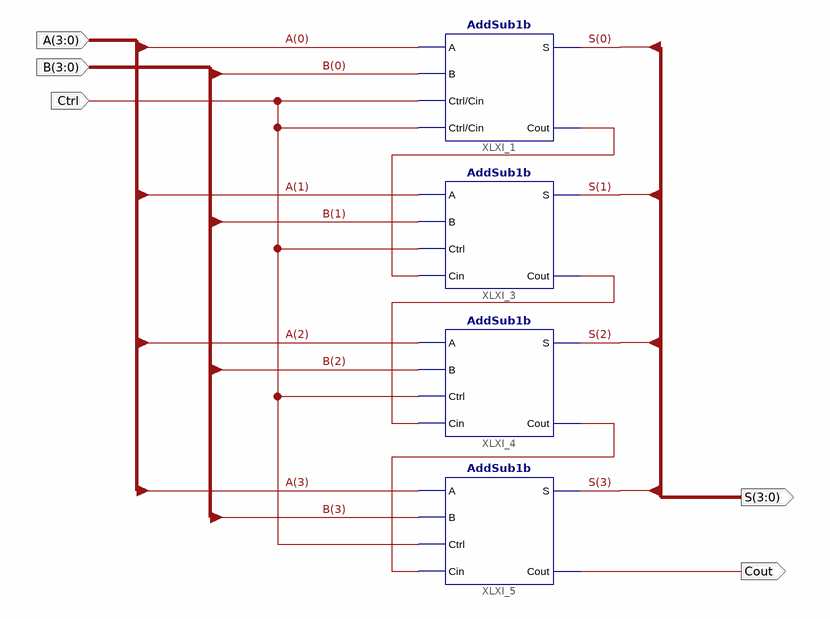
[diagram p0: schematic sheet 1]
// Xilinx ISE schematic AddSub4b.sch (kintex7) as structural Verilog: 4 symbols, 5 ports
module AddSub4b (
  input  [3:0] A,
  input  [3:0] B,
  input  Ctrl,
  output [3:0] S,
  output Cout
);

  wire XLXN_16, XLXN_17, XLXN_18;

  AddSub1b XLXI_1 (.A(A[0]), .B(B[0]), .Ctrl(Ctrl), .Cin(Ctrl), .S(S[0]), .Cout(XLXN_16));
  AddSub1b XLXI_3 (.A(A[1]), .B(B[1]), .Ctrl(Ctrl), .Cin(XLXN_16), .S(S[1]), .Cout(XLXN_17));
  AddSub1b XLXI_4 (.A(A[2]), .B(B[2]), .Ctrl(Ctrl), .Cin(XLXN_17), .S(S[2]), .Cout(XLXN_18));
  AddSub1b XLXI_5 (.A(A[3]), .B(B[3]), .Ctrl(Ctrl), .Cin(XLXN_18), .S(S[3]), .Cout(Cout));
endmodule
